# Altium schematic sheet Control Board.SchDoc
size A; SheetNumber: 1; SheetTotal: 1
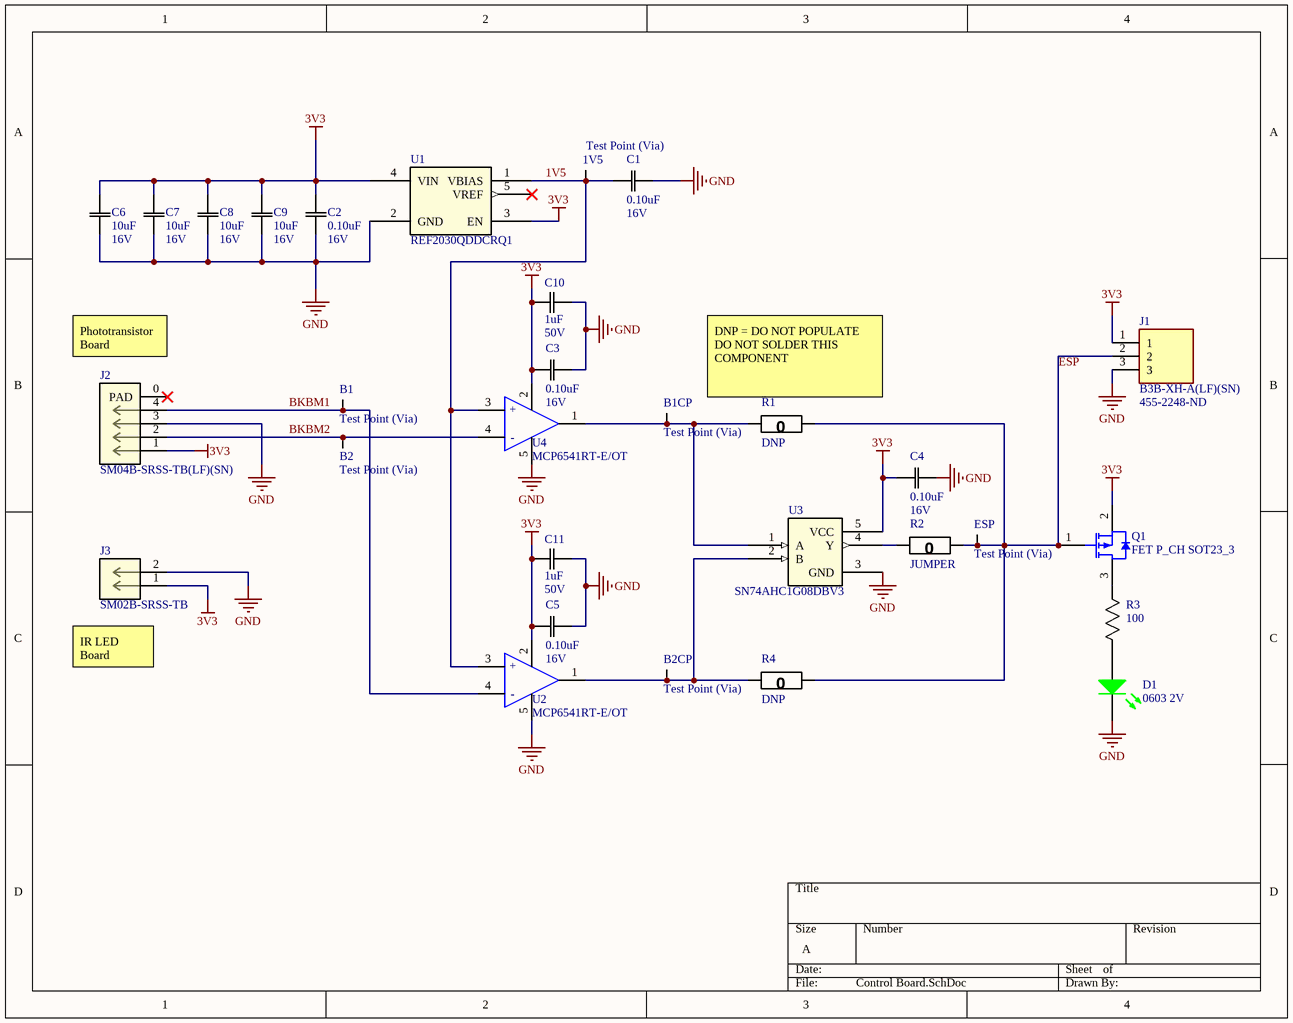
[diagram p0: Control Board.SchDoc]

## Parts
1V5  Test Point (Via)  [TP]  (no BOM)
B1  Test Point (Via)  [TP]  (no BOM)
B1CP  Test Point (Via)  [TP]  (no BOM)
B2  Test Point (Via)  [TP]  (no BOM)
B2CP  Test Point (Via)  [TP]  (no BOM)
C1  Rating: 16V  [0603]  (hidden comment: 0.10uF)
C2  Rating: 16V  [0603]  (hidden comment: 0.10uF)
C3  Rating: 16V  [0603]  (hidden comment: 0.10uF)
C4  Rating: 16V  [0603]  (hidden comment: 0.10uF)
C5  Rating: 16V  [0603]  (hidden comment: 0.10uF)
C6  Rating: 16V  [0603]  (hidden comment: 10uF)
C7  Rating: 16V  [0603]  (hidden comment: 10uF)
C8  Rating: 16V  [0603]  (hidden comment: 10uF)
C9  Rating: 16V  [0603]  (hidden comment: 10uF)
C10  Rating: 50V  [0603]  (hidden comment: 1uF)
C11  Rating: 50V  [0603]  (hidden comment: 1uF)
D1  0603 2V  [0603 - LED]
ESP  Test Point (Via)  [TP]  (no BOM)
J1  B3B-XH-A(LF)(SN)  Supplier Part Number 1: 455-2248-ND  [JST_B3B-XH-A(LF)(SN)]
J2  SM04B-SRSS-TB(LF)(SN)  [CONN_SM04B_JST]
J3  SM02B-SRSS-TB  [SM02B-SRSS-TB(LF)(SN)]
Q1  FET P_CH SOT23_3  [SOT-23A-3]
R1  DNP  [0603]
R2  JUMPER  [0603]
R3  100  [0603]
R4  DNP  [0603]
U1  REF2030QDDCRQ1  [SOT-23-5_MC_MCH-L]
U2  MCP6541RT-E/OT  [SOT-23-5_MC_MCH-L]
U3  SN74AHC1G08DBV3  [SOT-23-5_MC_MCH-L]
U4  MCP6541RT-E/OT  [SOT-23-5_MC_MCH-L]

## Nets
3V3: C2.1(C1) C3.2(C2) C4.2(C2) C5.2(C2) C6.2(C2) C7.2(C2) C8.2(C2) C9.2(C2) C10.1(C1) C11.1(C1) J1.1 J2.1 J3.1 Q1.2(SOURCE) U1.3(EN) U1.4(VIN) U2.2(V+) U3.5(VCC) U4.2(V+)
GND: C1.1(C1) C2.2(C2) C3.1(C1) C4.1(C1) C5.1(C1) C6.1(C1) C7.1(C1) C8.1(C1) C9.1(C1) C10.2(C2) C11.2(C2) D1.2(K) J1.3 J2.3 J3.2 U1.2(GND) U2.5(V-) U3.3(GND) U4.5(V-)
1V5: 1V5.1 C1.2(C2) U1.1(VBIAS) U2.3(IN+) U4.3(IN+)
BKBM1: B1.1 J2.4 U2.4(IN-)
BKBM2: B2.1 J2.2 U4.4(IN-)
ESP: ESP.1 J1.2 Q1.1(GATE) R1.1(R1) R2.1(R1) R4.1(R1)
NetB1CP_1: B1CP.1 R1.2(R2) U3.1(A) U4.1(OUT)
NetB2CP_1: B2CP.1 R4.2(R2) U2.1(OUT) U3.2(B)
NetD1_1: D1.1(A) R3.1(R1)
NetQ1_3: Q1.3(DRAIN) R3.2(R2)
NetR2_2: R2.2(R2) U3.4(Y)

Not connected (* = marked no-connect by the designer): J2 0(PAD)*; U1 5(VREF)*

## Notes on the sheet
- (near J2) Phototransistor Board
- DNP = DO NOT POPULATE
  DO NOT SOLDER THIS COMPONENT
- (near J3) IR LED Board
- (in symbol COMPARATOR MCP6541RT-EOT) +; -

## Library data of the parts
C1-C5 = CAP 0.10uF 16V: CAP CER 0.10UF 16V X5R 0603; Tolerance: 10%; Package: 0603/0805; Temperature Coefficient: X5R; Operating Temperature: -55°C ~ 85°C; Value: 0.10uF; Part Number: CAP 0.10uF 16V
C6-C9 = CAP 10uF 16V: CAP CER 10UF 16V X5R 0603/0805; Tolerance: 10%; Package: 0603/0805; Temperature Coefficient: X5R; Operating Temperature: -55°C ~ 85°C; Value: 10uF; Part Number: CAP 10uF 16V
C10 C11 = CAP 1uF 50V: Default Symbol for Capacitors; Temperature Coefficient: X7R; Tolerance: 10%; Value: 1uF; Part Number: CAP 1uF 50V
D1 = LED GREEN SMD 0603: LED Uni-Color Green 574nm 2-Pin Chip LED T/R; Manufacturer Part Number 1: LTST-C190KGKT; Current Rating: 20mA; Part Number: LED GREEN SMD 0603; Supplier 1: Digi-Key; Supplier Part Number 1: 160-1435-1-ND; Supplier URL 1: https://www.digikey.ca/en/products/detail/lite-on-inc/LTST-C190KGKT/386815?s=N4IgTCBcDaIIwDYAMBaOAWAzAVjSgcgCIgC6AvkA; Pin Count: 2; Voltage Rating - DC: 2V
J1 = CN HDR 3POS JST XH: Connector Header Through Hole 3 position 0.098 (2.50mm); MF: JST Sales; Check_prices: https://www.snapeda.com/parts/B3B-XH-A(LF)(SN)/JST%20Sales%20America%20Inc./view-part/231271/?ref=eda; Value: *; Package: None; Price: None; Availability: In Stock; MP: B3B-XH-A(LF)(SN); SnapEDA_Link: https://www.snapeda.com/parts/B3B-XH-A(LF)(SN)/JST%20Sales%20America%20Inc./view-part/231271/?ref=snap; Supplier 1: Digi-Key; Part Number: CN HDR 3POS JST XH; Manufacturer Part Number 1: B3B-XH-A(LF)(SN); Supplier URL 1: https://www.digikey.com/en/products/detail/jst-sales-america-inc/B3B-XH-A-LF-SN/1651046
J2 = CN HDR 4POS JST SH_SR: CONN HEADER SMD R/A 4POS 1MM; Mfr_Name: JST; Part Number: CN HDR 4POS JST SH_SR; Copyright: Copyright (C) 2023 Ultra Librarian. All rights reserved.; Manufacturer_Part_Number: SM04B-SRSS-TB(LF)(SN); Digi-Key_Part_Number_1: 455-1804-2-ND; Digi-Key_Part_Number_2: 455-1804-1-ND; Digi-Key_Part_Number_3: 455-1804-6-ND; RefDes: RefDes; Type: DEV; Supplier 1: Digi-Key; Supplier Part Number 1: 455-1804-1-ND; Supplier URL 1: https://www.digikey.ca/en/products/detail/jst-sales-america-inc/SM04B-SRSS-TB-LF-SN/926710; Pin Count: 4
J3 = CN HDR 2POS 90 JST SH: No Description Available; Mfr_Name: JST; Copyright: Copyright (C) 2023 Ultra Librarian. All rights reserved.; Manufacturer_Part_Number: SM02B-SRSS-TB; RefDes: RefDes; Type: DEV; Part Number: CN HDR 2POS 90 JST SH; Manufacturer Part Number 1: SM02B-SRSS-TB(LF)(SN); Supplier 1: Digi-Key; Supplier Part Number 1: 455-1802-2-ND; Supplier URL 1: https://www.digikey.ca/en/products/detail/jst-sales-america-inc/SM02B-SRSS-TB-LF-SN/926708; Pin Count: 2
Q1 = MOSFET P-CH CJ2305: P-Channel MOSFET General Purpose P-CH SOT23-3; Part Number: MOSFET P-CH CJ2305
R1 R2 R4 = RES 0 JUMPER: RES SMD 0 OHM JUMPER GENERIC 0603; Manufacturer Part Number 1: RK73Z1JTTD; Value: 0; Tolerance: N/A; Package: 0805; Part Number: RES 0 JUMPER; Supplier 1: Digi-Key; Supplier Part Number 1: 2019-RK73Z1JTTDCT-ND; Supplier URL 1: https://www.digikey.ca/en/products/detail/koa-speer-electronics-inc/RK73Z1JTTD/9845478
R3 = RES 100.0 1/8W - 5%: Default Resistor Symbol; Manufacturer Part Number 1: RK73B1JRTTD101J; Power (Watts): 0.125W; Tolerance: 5%; Package: 0805; Value: 100; Part Number: RES 100.0 1/8W - 5%; Supplier 1: Digi-Key; Supplier Part Number 1: 2019-RK73B1JRTTD101JCT-ND; Supplier URL 1: https://www.digikey.ca/en/products/detail/koa-speer-electronics-inc/RK73B1JRTTD101J/12156165?s=N4IgTCBcDaIEoGkDsBmAQgRgFJwCq4BEMAGbAYVxAF0BfIA; Manufacturer Part Number 2: RMCF0805JT100R; Supplier 2: Digi-Key; Supplier Part Number 2: RMCF0805JT100RCT-ND; Supplier URL 2: https://www.digikey.ca/en/products/detail/stackpole-electronics-inc/RMCF0805JT100R/1757756?s=N4IgTCBcDaIEoFkDCAxADADjQVgFIBUBGNNOJfEAXQF8g; Tolerance 2: 5%
U1 = REF2030QDDCRQ1: Series Voltage Reference IC Fixed 1.5V, 3V V ±0.05% 20 mA SOT-23-THIN; Mfr_Name: Texas Instruments; Manufacturer_Part_Number: SN74AHC1G08DBV3; Copyright: Copyright (C) 2023 Ultra Librarian. All rights reserved.; Digi-Key_Part_Number_1: 2156-SN74AHC1G08DBV3-ND; Digi-Key_Part_Number_2: 296-SN74AHC1G08DBV3CT-ND; Digi-Key_Part_Number_3: 296-SN74AHC1G08DBV3DKR-ND; Digi-Key_Part_Number_4: 296-SN74AHC1G08DBV3TR-ND; RefDes: RefDes; Type: DEV; Part Number: REF2030QDDCRQ1; Manufacturer Part Number 1: REF2030QDDCRQ1; Supplier 1: Digi-Key; Supplier Part Number 1: 296-REF2030QDDCRQ1CT-ND; Supplier URL 1: https://www.digikey.ca/en/products/detail/texas-instruments/REF2030QDDCRQ1/15926651?s=N4IgjCBcpg7LBOKoDGUBmBDANgZwKYA0IA9lANogCsVAHHSALrEAOALlCAMpsBOAlgDsA5iAC%2BxALQAmZCDSQ%2BAVyKkK1JmK1A
U2 U4 = COMPARATOR MCP6541RT-EOT: IC COMP 1.6V SNGL P-P SOT23-5; Part Number: COMPARATOR MCP6541RT-EOT; Manufacturer Part Number 1: MCP6541RT-E/OT; Supplier 1: Digi-Key; Supplier Part Number 1: MCP6541RT-E/OTCT-ND; Supplier URL 1: https://www.digikey.ca/en/products/detail/microchip-technology/MCP6541RT-E-OT/870211
U3 = SN74AHC1G08DBV3: IC GATE AND 1CH 2-INP SOT23-5; Mfr_Name: Texas Instruments; Copyright: Copyright (C) 2023 Ultra Librarian. All rights reserved.; Manufacturer_Part_Number: SN74AHC1G08DBV3; Digi-Key_Part_Number_1: 2156-SN74AHC1G08DBV3-ND; Digi-Key_Part_Number_2: 296-SN74AHC1G08DBV3CT-ND; Digi-Key_Part_Number_3: 296-SN74AHC1G08DBV3DKR-ND; Digi-Key_Part_Number_4: 296-SN74AHC1G08DBV3TR-ND; RefDes: RefDes; Type: DEV; Part Number: SN74AHC1G08DBV3; Manufacturer Part Number 1: SN74AHC1G08DBV3; Supplier 1: Digi-Key; Supplier Part Number 1: 296-SN74AHC1G08DBV3CT-ND; Supplier URL 1: https://www.digikey.ca/en/products/detail/texas-instruments/SN74AHC1G08DBV3/10434480
1V5 B1 B1CP B2 B2CP ESP = Test Point (Via): Part Number: Test Point (Via)